# EAGLE design ProjekITS_5 (EAGLE 9.6.2)
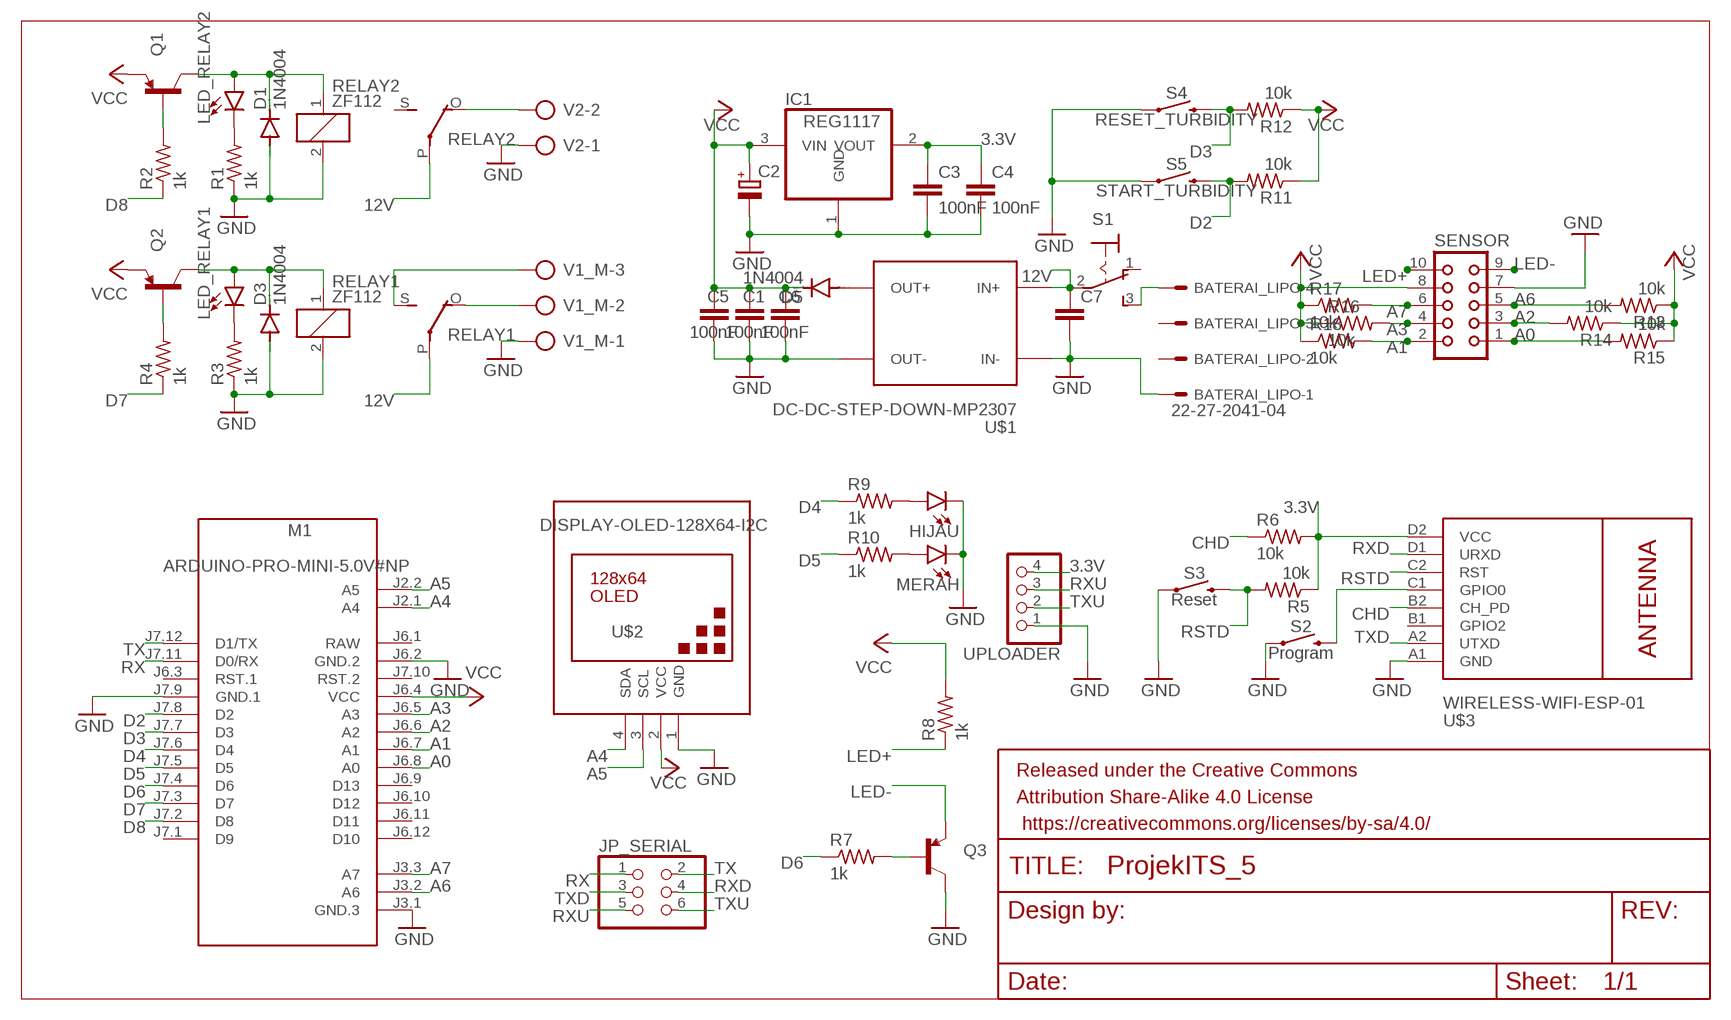
[diagram p0: schematic, sheet 1]

## Parts
BATERAI_LIPO  22-27-2041-04  [6410-04]
C1  100nF  C-EUC0805K  [C0805K]
C2  CPOL-EUCT3528  [CT3528]
C3  100nF  C-EUC0805K  [C0805K]
C4  100nF  C-EUC0805K  [C0805K]
C5  100nF  C-EUC0805K  [C0805K]
C6  100nF  C-EUC0805K  [C0805K]
C7  C-EU050-030X075  [C050-030X075]
D1  1N4004  [DO41-10]
D3  1N4004  [DO41-10]
D5  1N4004  [DO41-10]
FRAME1  FRAME-LETTER  [CREATIVE_COMMONS]
HIJAU  LED5MM  [LED_5MM]
IC1  REG1117  [SOT223]
JP_SERIAL  PINHD-2X3  [2X03]
LED_RELAY1  LED3MM  [LED_3MM]
LED_RELAY2  LED3MM  [LED_3MM]
M1  ARDUINO-PRO-MINI-5.0V#NP  [ARDUINO-PRO-MINI#NP]
MERAH  LED5MM  [LED_5MM]
Q1  TRANSISTOR_PNPSMD  [SOT23-3]
Q2  TRANSISTOR_PNPSMD  [SOT23-3]
Q3  TRANSISTOR_PNPSMD  [SOT23-3]
R1  1k  R-US_R0805  [R0805]
R2  1k  R-US_R0805  [R0805]
R3  1k  R-US_R0805  [R0805]
R4  1k  R-US_R0805  [R0805]
R5  10k  R-US_R0805  [R0805]
R6  10k  R-US_R0805  [R0805]
R7  1k  R-US_R0805  [R0805]
R8  1k  R-US_R0805  [R0805]
R9  1k  R-US_R0805  [R0805]
R10  1k  R-US_R0805  [R0805]
R11  10k  R-US_R0805  [R0805]
R12  10k  R-US_R0805  [R0805]
R13  10k  R-US_R0805  [R0805]
R14  10k  R-US_R0805  [R0805]
R15  10k  R-US_R0805  [R0805]
R16  10k  R-US_R0805  [R0805]
R17  10k  R-US_R0805  [R0805]
R18  10k  R-US_R0805  [R0805]
RELAY1  ZF112  [ZF112]
RELAY2  ZF112  [ZF112]
S1  320-916  [320-916]
S2  Program  MOMENTARY-SWITCH-SPST-PTH-6.0MM  [TACTILE_SWITCH_PTH_6.0MM]
S3  Reset  MOMENTARY-SWITCH-SPST-PTH-6.0MM  [TACTILE_SWITCH_PTH_6.0MM]
S4  RESET_TURBIDITY  MOMENTARY-SWITCH-SPST-PTH-6.0MM  [TACTILE_SWITCH_PTH_6.0MM]
S5  START_TURBIDITY  MOMENTARY-SWITCH-SPST-PTH-6.0MM  [TACTILE_SWITCH_PTH_6.0MM]
SENSOR  CON10L  [CON10L]
U$1  DC-DC-STEP-DOWN-MP2307  [DC-DC-STEP-DOWN-MP2307]
U$2  DISPLAY-OLED-128X64-I2C  [DISPLAY-OLED-128X64-I2C]
U$3  WIRELESS-WIFI-ESP-01  [WIRELESS-WIFI-ESP-01]
UPLOADER  PINHD-1X4/90  [1X04/90]
V1_M  AK500/3  [AK500/3]
V2  AK500/2  [AK500/2]

## Nets
3.3V: C3.1 C4.1 IC1.2(VOUT) R5.1 R6.2 U$3.D2(VCC) UPLOADER.4
12V: C7.1 RELAY1.P(2:P) RELAY2.P(2:P) S1.2(P) U$1.IN+
A0: M1.J6.8(A0) R15.2 SENSOR.1
A1: M1.J6.7(A1) R18.2 SENSOR.2
A2: M1.J6.6(A2) R14.2 SENSOR.3
A3: M1.J6.5(A3) R16.2 SENSOR.4
A4: M1.J2.1(A4) U$2.4(SDA)
A5: M1.J2.2(A5) U$2.3(SCL)
A6: M1.J3.2(A6) R13.2 SENSOR.5
A7: M1.J3.3(A7) R17.2 SENSOR.6
CHD: R6.1 U$3.B2(CH_PD)
D2: M1.J7.8(D2) R11.2 S5.3
D3: M1.J7.7(D3) R12.2 S4.3
D4: M1.J7.6(D4) R9.1
D5: M1.J7.5(D5) R10.1
D6: M1.J7.4(D6) R7.1
D7: M1.J7.3(D7) R4.1
D8: M1.J7.2(D8) R2.1
GND: BATERAI_LIPO.1 C1.2 C2.- C3.2 C4.2 C5.2 C6.2 C7.2 D1.A D3.A HIJAU.K(C) IC1.1(GND) M1.J3.1(GND.3) M1.J6.2(GND.2) M1.J7.9(GND.1) MERAH.K(C) Q3.3(C) R1.1 R3.1 RELAY1.2 RELAY2.2 S2.1 S3.1 S4.1 S5.1 SENSOR.7 U$1.IN- U$1.OUT- U$2.1(GND) U$3.A1(GND) UPLOADER.1 V1_M.1 V2.1
LED+: R8.1 SENSOR.10
LED-: Q3.2(E) SENSOR.9
N$1: D1.C LED_RELAY2.A Q1.3(C) RELAY2.1
N$2: HIJAU.A R9.2
N$3: D5.A U$1.OUT+
N$4: LED_RELAY2.K(C) R1.2
N$5: Q1.1(B) R2.2
N$6: D3.C LED_RELAY1.A Q2.3(C) RELAY1.1
N$7: LED_RELAY1.K(C) R3.2
N$8: Q2.1(B) R4.2
N$9: RELAY2.O(2:O) V2.2
N$10: RELAY1.S(2:S) V1_M.3
N$11: RELAY1.O(2:O) V1_M.2
N$12: MERAH.A R10.2
N$13: BATERAI_LIPO.4 S1.3(S)
N$16: Q3.1(B) R7.2
N$17: S2.3 U$3.C1(GPIO0)
RSTD: R5.2 S3.3 U$3.C2(RST)
RX: JP_SERIAL.1 M1.J7.11(D0/RX)
RXD: JP_SERIAL.4 U$3.D1(URXD)
RXU: JP_SERIAL.5 UPLOADER.3
TX: JP_SERIAL.2 M1.J7.12(D1/TX)
TXD: JP_SERIAL.3 U$3.A2(UTXD)
TXU: JP_SERIAL.6 UPLOADER.2
VCC: C1.1 C2.+ C5.1 C6.1 D5.C IC1.3(VIN) M1.J6.4(VCC) Q1.2(E) Q2.2(E) R8.2 R11.1 R12.1 R13.1 R14.1 R15.1 R16.1 R17.1 R18.1 SENSOR.8 U$2.2(VCC)
Unconnected: BATERAI_LIPO.2 BATERAI_LIPO.3 M1.J6.3(RST.1) M1.J6.9(D13) M1.J6.10(D12) M1.J6.11(D11) M1.J6.12(D10) M1.J7.1(D9) M1.J7.10(RST.2) RELAY2.S(2:S) S1.1(O) U$3.B1(GPIO2)

## Power pins joined to a net without a drawn wire
RAW: M1.J6.1(RAW)

## Library data of the parts
BATERAI_LIPO = con-molex:22-?-04: CONNECTOR wire to board 2.54 mm (.1 inch) pitch header; MF: MOLEX; OC_FARNELL: unknown; OC_NEWARK: unknown
C1 C3-C7 = rcl:C-EU: CAPACITOR, European symbol; SPICEPREFIX: C
C2 = rcl:CPOL-EU: POLARIZED CAPACITOR, European symbol; SPICEPREFIX: C
D1 D3 D5 = diode:1N4004: DIODE general purpose rectifier, 1 A
FRAME1 = SparkFun-Aesthetics:FRAME-LETTER: Schematic Frame - Letter Standard 8.5x11 US Letter frame
HIJAU MERAH = SparkFun-LED:LED: LED (Generic) Standard schematic elements and footprints for 5mm, 3mm, 1206, and 0603 sized LEDs. Generic LEDs with no color specified.
IC1 = burr-brown:REG1117: 800mA and 1A Low Dropout (LDO) Positive Regulator 1.8V, 2.5V, 2.85V, 3.3V, 5V, and Adj; MPN: REG1117; OC_FARNELL: 1097566; OC_NEWARK: 14P6981
JP_SERIAL = pinhead:PINHD-2X3: PIN HEADER
LED_RELAY1 LED_RELAY2 = SparkFun-LED:LED: LED (Generic) Standard schematic elements and footprints for 5mm, 3mm, 1206, and 0603 sized LEDs. Generic LEDs with no color specified.; PROD_ID: DIO-08794
M1 = diy-modules:ARDUINO-PRO-MINI-*#NP: Arduino Pro Mini (and compatible devices) without programming pads More details available here: https://www.arduino.cc/en/Main/ArduinoBoardProMini Click here to find device on ebay.com <http://www.ebay.com/sch/arduino+pro+mini>
Q1-Q3 = User-Submitted:TRANSISTOR_PNP: Generic PNP BJT Double check pinouts against datasheets- not all devices are the same! MMBT3906 - 40V 200mA SOT-23 (TRANS-08052) MMBT4403 - 40V 600mA SOT-23 (TRANS-09245)
R1-R18 = rcl:R-US_: RESISTOR, American symbol; SPICEPREFIX: R
RELAY1 RELAY2 = relay:ZF112: RELAY 1 x switch; OC_FARNELL: unknown; OC_NEWARK: unknown
S1 = switch:320-916: TOGGLE SWITCH distributor RS Components
S2-S5 = SparkFun-Switches:MOMENTARY-SWITCH-SPST: Momentary Switch (Pushbutton) - SPST Normally-open (NO) SPST momentary switches (buttons, pushbuttons). Variants PTH-12MM - 12mm square, through-hole Momentary Pushbutton Switch - 12mm Square <https://www.sparkfun.com/products/9190> (COM-09190) PTH-6.0MM, PTH-6.0MM-KIT - 6.0mm square, through-hole Mini Pushbutton Switch <https://www.sparkfun.com/products/97> (COM-00097) KIT package intended for soldering kit's - only one side of pads' copper is exposed. PTH-RIGHT-ANGLE-KIT - Right-angle, through-hole Right Angle Tactile Button <https://www.sparkfun.com/products/10791> - Used on SparkFun BigTime Watch Kit <https://www.sparkfun.com/products/11734> SMD-12MM - 12mm square, surface-mount Tactile Button - SMD (12mm) <https://www.sparkfun.com/products/12993> (COM-12993) Used on SparkFun PicoBoard <https://www.sparkfun.com/products/11888> SMD-4.5MM - 4.5mm Square Trackball Switch Used on SparkFun Blackberry Trackballer Breakout <https://www.sparkfun.com/products/13169> SMD-4.6MMX2.8MM - 4.60mm x 2.80mm, surface mount Used on SparkFun SAMD21 Mini Breakout <https://www.sparkfun.com/products/13664> SMD-5.2MM, SMD-5.2-REDUNDANT - 5.2mm square, surface-mount Mini Pushbutton Switch - SMD <https://www.sparkfun.com/products/8720> (COM-08720) Used on Arduino Pro Mini <https://www.sparkfun.com/products/11114> REDUNDANT package connects both switch circuits together SMD-6.0X3.5MM - 6.0 x 3.5mm, surface mount Momentary Reset Switch SMD <https://www.sparkfun.com/products/8229> (COM-08229) SMD-6.2MM-TALL - 6.2mm square, surface mount Tactile Button - SMD (6mm) <https://www.sparkfun.com/products/12992> Used on SparkFun Digital Sandbox <https://www.sparkfun.com/products/12651> SMD-RIGHT-ANGLE - Right-angle, surface mount Used on SparkFun Block for Intel® Edison - Arduino <https://www.sparkfun.com/products/13036>; PROD_ID: SWCH-08441; SF_SKU: COM-00097
SENSOR = con-harting:CON10L: CONNECTOR; OC_FARNELL: unknown; OC_NEWARK: unknown
U$1 = diy-modules:DC-DC-STEP-DOWN-MP2307: DC/DC Step-Down Regulator based on MP2307DN chip MP2307 datasheet available here: https://cdn-shop.adafruit.com/datasheets/MP2307_r1.9.pdf Click here to find device on ebay.com <http://www.ebay.com/sch/dc+dc+3a+mini+converter>
U$2 = diy-modules:DISPLAY-OLED-128X64-I2C: 128x64 Dot Matrix OLED Module based on SSD1306 chip Variant with I2C interface More details available here: http://www.instructables.com/id/Monochrome-096-i2c-OLED-display-with-arduino-SSD13/ SSD1306 datasheet: https://cdn-shop.adafruit.com/datasheets/SSD1306.pdf Click here to find device on ebay.com <http://www.ebay.com/sch/oled+display+128x64+iic> Note: There are two variants: I2C and SPI. Search for the proper version.
U$3 = diy-modules:WIRELESS-WIFI-ESP-01: Wireless Wi-Fi ESP-01 Module based on ESP8266 chip Click here to find device on ebay.com <http://www.ebay.com/sch/esp8266+esp+01+transceiver>
UPLOADER = pinhead:PINHD-1X4: PIN HEADER
V1_M = con-ptr500:AK500/3: CONNECTOR; OC_FARNELL: unknown; OC_NEWARK: unknown
V2 = con-ptr500:AK500/2: CONNECTOR; OC_FARNELL: unknown; OC_NEWARK: unknown

## Board
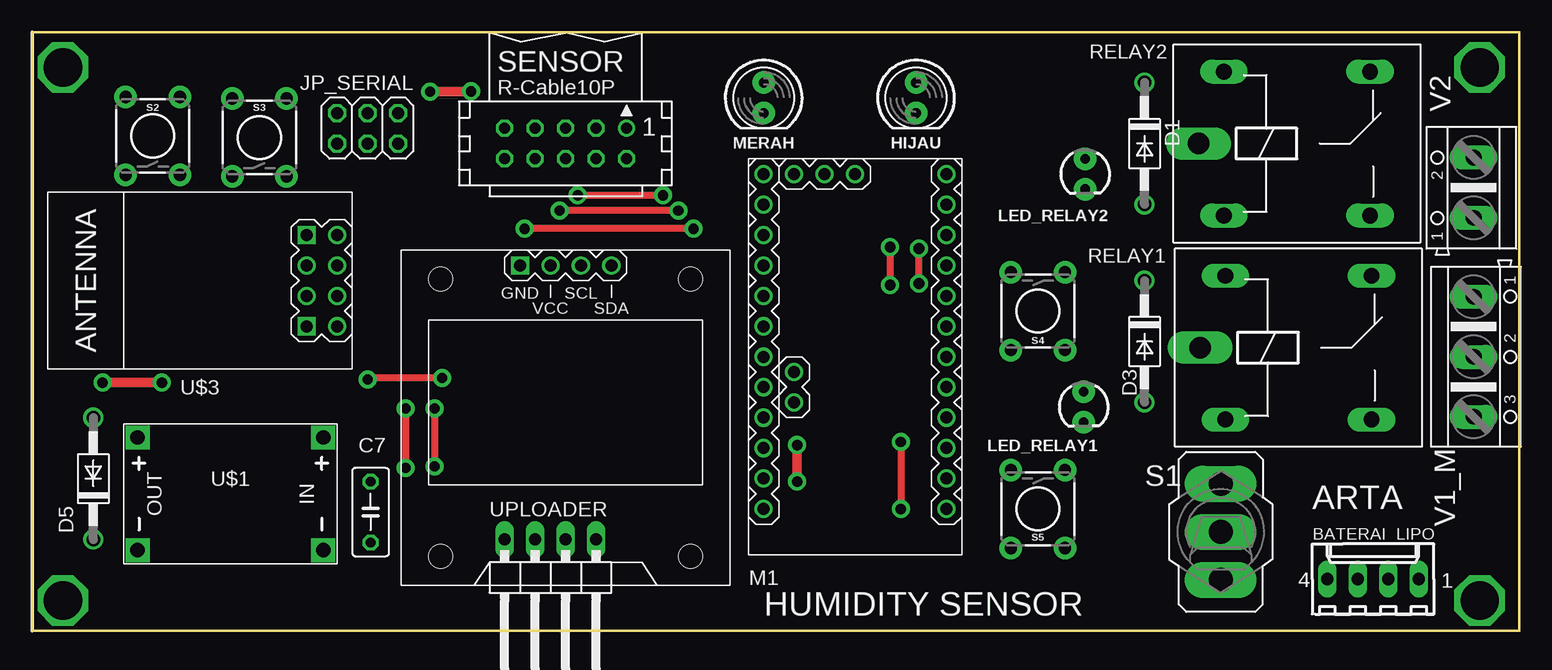
[diagram p1: board, top side]
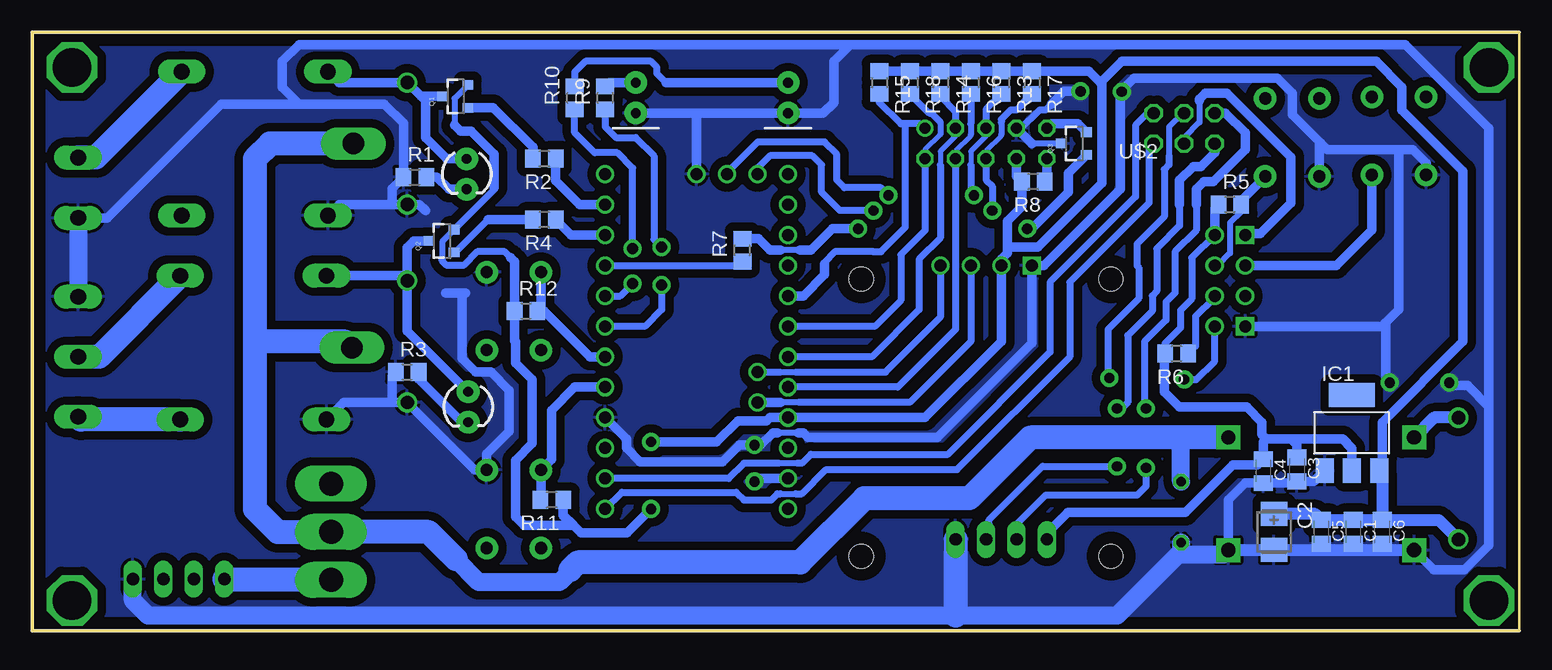
[diagram p2: board, bottom side, seen from below]

Size 123.95 x 49.91 mm. Coordinates in mm from the lower left corner, seen from the top.
Outline: 0,0 123.95,0 123.95,49.91 0,49.91 0,0
Copper layers (1*16): Top 0.035mm / dielectric 1.5mm / Bottom 0.035mm
Design rules "default": minimum track width 6mil, minimum drill 0.35mm, track to track 6mil, track to pad 6mil, pad to pad 6mil, via to via 6mil, smd to smd 6mil, copper to edge 40mil, drill to drill 6mil, minimum pad ring 10mil, minimum via ring 8mil, stop-mask expansion 4mil, vias tented up to drill 0mil, thermal gap 10mil

### Footprints (pad centres in the part's own frame; a part is rotated, then mirrored left to right if it is on the bottom)
6410-04 = drill 1.016 long: 1 3.81,0; 2 1.27,0; 3 -1.27,0; 4 -3.81,0
C0805K = smd 1.3 x 1.6: 1 -1,0; 2 1,0
CT3528 = smd 2 x 2.2: + -1.5,0; - 1.5,0
C050-030X075 = drill 0.813 octagon: 1 -2.54,0; 2 2.54,0
DO41-10 = drill 1.118: A 5.08,0; C -5.08,0
LED_5MM = drill 0.813 pad 1.88: A -1.27,0; K 1.27,0
SOT223 = smd 1.499 x 2.007: 1 -2.261,-3.15; 2 0.025,-3.15; 3 2.311,-3.15 | smd 3.81 x 2.007: 4 0,3.15
2X03 = drill 1.016 octagon: 1 -2.54,-1.27; 2 -2.54,1.27; 3 0,-1.27; 4 0,1.27; 5 2.54,-1.27; 6 2.54,1.27
LED_3MM = drill 0.813 pad 1.88: A -1.27,0; K 1.27,0
ARDUINO-PRO-MINI#NP = drill 1: J2.1 -1.27,5.08; J2.2 -3.81,5.08; J3.1 15.24,0; J3.2 15.24,2.54; J3.3 15.24,5.08; J6.1 -12.7,7.62; J6.2 -10.16,7.62; J6.3 -7.62,7.62; J6.4 -5.08,7.62; J6.5 -2.54,7.62; J6.6 0,7.62; J6.7 2.54,7.62; J6.8 5.08,7.62; J6.9 7.62,7.62; J6.10 10.16,7.62; J6.11 12.7,7.62; J6.12 15.24,7.62; J7.1 15.24,-7.62; J7.2 12.7,-7.62; J7.3 10.16,-7.62; J7.4 7.62,-7.62; J7.5 5.08,-7.62; J7.6 2.54,-7.62; J7.7 0,-7.62; J7.8 -2.54,-7.62; J7.9 -5.08,-7.62; J7.10 -7.62,-7.62; J7.11 -10.16,-7.62; J7.12 -12.7,-7.62
SOT23-3 = smd 0.8 x 0.9: 1 -0.95,-1; 2 0.95,-1; 3 0,1.1
R0805 = smd 1.3 x 1.5: 1 -0.95,0; 2 0.95,0
ZF112 = drill 1.321 long: 1 -6.096,5.994; 2 -6.096,-5.994; O 6.096,5.994; S 6.096,-5.994 | drill 1.803 long: P -8.204,0
320-916 = drill 2.007 long: 1 0,4.013; 2 0,0; 3 0,-4.013
TACTILE_SWITCH_PTH_6.0MM = drill 1.016 pad 1.88: 1 -3.251,2.261; 2 3.251,2.261; 3 -3.251,-2.261; 4 3.251,-2.261
CON10L = drill 0.914: 1 5.08,1.27 | drill 0.914 octagon: 2 5.08,-1.27; 3 2.54,1.27; 4 2.54,-1.27; 5 0,1.27; 6 0,-1.27; 7 -2.54,1.27; 8 -2.54,-1.27; 9 -5.08,1.27; 10 -5.08,-1.27
DC-DC-STEP-DOWN-MP2307 = drill 1.2 pad 2 square: IN+ -7.747,-4.699; IN- -7.747,4.699; OUT+ 7.747,-4.699; OUT- 7.747,4.699
DISPLAY-OLED-128X64-I2C = drill 1 square: 1 -3.81,12.7 | drill 1: 2 -1.27,12.7; 3 1.27,12.7; 4 3.81,12.7 | hole 2: -10.414,11.557; 10.414,11.557; 10.414,-11.557; -10.414,-11.557
WIRELESS-WIFI-ESP-01 = drill 1 square: A1 -8.89,3.81; D1 -8.89,-3.81 | drill 1: A2 -11.43,3.81; B1 -8.89,1.27; B2 -11.43,1.27; C1 -8.89,-1.27; C2 -11.43,-1.27; D2 -11.43,-3.81
1X04/90 = drill 1.016 long: 1 -3.81,-3.81; 2 -1.27,-3.81; 3 1.27,-3.81; 4 3.81,-3.81
AK500/3 = drill 1.321 long: 1 -5.004,0; 2 0,0; 3 5.004,0
AK500/2 = drill 1.321 long: 1 -2.515,0; 2 2.515,0

### Placement (x,y rotation side)
BATERAI_LIPO  111.76,4.32 0 top
C1  13.84,8.26 270 bottom
C2  20.45,8.26 270 bottom
C3  18.54,13.46 270 bottom
C4  21.34,13.34 270 bottom
C5  16.51,8.26 270 bottom
C6  11.43,8.26 270 bottom
C7  28.19,9.91 270 top
D1  92.71,40.64 270 top
D3  92.71,24.13 270 top
D5  5.08,12.7 90 top
FRAME1  21.59,-11.43 0 top  (outside the outline)
HIJAU  73.66,44.45 270 top
IC1  13.97,16.51 0 bottom
JP_SERIAL  27.94,41.91 180 top
LED_RELAY1  87.63,18.67 270 top
LED_RELAY2  87.76,38.1 270 top
M1  68.58,22.86 90 top
MERAH  60.96,44.45 270 top
Q1  88.65,44.58 90 bottom
Q2  89.79,32.51 90 bottom
Q3  37.08,40.64 90 bottom
R1  92.08,37.85 0 bottom
R2  81.28,39.37 180 bottom
R3  92.71,21.59 0 bottom
R4  81.28,34.29 180 bottom
R5  24.13,35.56 0 bottom
R6  28.57,23.11 180 bottom
R7  64.77,31.75 90 bottom
R8  40.51,37.47 180 bottom
R9  76.2,44.45 90 bottom
R10  78.74,44.45 90 bottom
R11  80.64,10.92 180 bottom
R12  82.8,26.67 0 bottom
R13  43.18,45.72 270 bottom
R14  48.26,45.72 270 bottom
R15  53.34,45.72 270 bottom
R16  45.72,45.72 270 bottom
R17  40.64,45.72 270 bottom
R18  50.8,45.72 270 bottom
RELAY1  105.54,23.62 0 top
RELAY2  105.41,40.64 0 top
S1  99.06,8.26 0 top
S2  10.03,41.27 90 top
S3  18.92,41.15 90 top
S4  83.82,26.67 270 top
S5  83.82,10.16 270 top
SENSOR  44.45,40.64 0 top
U$1  16.51,11.43 180 top
U$2  44.45,17.78 0 top
U$3  13.97,29.21 180 top
UPLOADER  43.18,3.81 180 top
V1_M  120.14,22.86 270 top
V2  120.14,36.96 90 top

### Tracks (layer width: path | path; a pad name or v marks a point on that pad's centre or on a via)
3.3V
  Bottom 0.6: U$3.D2 27.3,31.11 27.3,27.69 28.25,26.74 28.25,25.27 29.52,24 R6.2
  Bottom 0.8: R5.1 25.4,35.24 U$3.D2 | IC1.2 13.95,15.21 14.73,16 19.05,16 | 19.05,16 21.08,16 | 21.08,16 21.34,15.75 C4.1 21.83,13.84 23.88,13.84 27.84,9.88 37.62,9.88 39.37,8.13 UPLOADER.4 | 19.05,16 18.54,15.49 C3.1 | 21.08,16 21.46,16.38 21.46,17.4 22.73,18.67 28.32,18.67 29.59,19.94 29.59,23.05 R6.2
12V
  Bottom 1.5: C7.1 28.19,15.88 27.94,16.13 | 78.49,5.71 78.49,5.59 80.01,4.06 86.74,4.06 88.65,5.97
  Bottom 2: U$1.IN+ 27.94,16.13 40.77,16.13 45.85,11.05 54.61,11.05 59.94,5.71 78.49,5.71 79.12,5.08 | 88.65,5.97 90.93,8.26 S1.2 103.5,8.26 105.41,10.16 105.41,24.13 | RELAY2.P 104.14,40.64 105.41,39.37 105.41,24.13 | RELAY1.P 97.84,24.13 105.41,24.13
A0
  Bottom 0.6: SENSOR.1 49.91,42.29 51.18,42.29 | R15.2 53.34,44.07 51.56,42.29 51.18,42.29 | 57.91,30.48 57.91,30.73 56.99,31.65 53.91,31.65 53.88,31.62 53.21,31.62 51.18,33.66 51.18,42.29
  Bottom 0.8: M1.J6.8 59.69,27.94 57.91,29.72 57.91,30.48 57.91,30.61
A1
  Bottom 0.4: SENSOR.2 49.53,40.13 48.26,41.4
  Bottom 0.5: 48.26,42.42 48.26,41.4
  Bottom 0.6: 50.8,44.45 R18.2 49.21,43.18 49.02,43.18 48.26,42.42 | SENSOR.2 49.53,33.4 51.56,31.37 51.56,27.56 53.72,25.4 M1.J6.7
A2
  Bottom 0.4: SENSOR.3 46.99,41.27 48.26,40.01 48.26,38.86
  Bottom 0.6: R14.2 48.26,44.58 46.99,43.31 SENSOR.3 | 48.26,38.86 48.26,32.77 50.04,30.99 50.04,26.8 53.98,22.86 M1.J6.6
A3
  Bottom 0.4: 45.72,41.4 45.72,41.27 46.99,40.01 SENSOR.4
  Bottom 0.5: 45.72,42.29 45.72,41.4
  Bottom 0.6: 45.72,44.2 R16.2 45.72,42.29 | M1.J6.5 51.82,20.32 46.99,25.15 SENSOR.4
A4
  Bottom 0.5: 61.59,21.59 60.33,21.59
  Bottom 0.6: U$2.4 48.26,26.16 52.83,21.59 60.33,21.59 | M1.J2.1 61.59,21.59
A5
  Bottom 0.5: 60.07,19.05 61.59,19.05
  Bottom 0.6: U$2.3 45.72,24.13 50.8,19.05 60.07,19.05
  Bottom 0.8: 61.59,19.05 M1.J2.2
A6  (via drill 0.85 pad 1.5)
  Top 0.6: v45.47,36.32 v52.58,36.32
  Bottom 0.4: 45.72,38.86 45.72,40.01 44.45,41.27 SENSOR.5
  Bottom 0.6: R13.2 44.45,43.5 SENSOR.5 | 45.72,38.86 45.72,36.58 v45.47,36.32 | v52.58,36.32 53.21,36.96 56.26,36.96 56.9,37.59 56.9,39.75 57.91,40.77 63.5,40.77 66.04,38.23 M1.J3.2
A7  (via drill 0.85 pad 1.5)
  Top 0.6: v53.85,35.05 v43.94,35.05
  Bottom 0.4: 43.18,41.4 43.18,41.27 44.45,40.01 SENSOR.6
  Bottom 0.5: 43.18,42.42 43.18,41.4
  Bottom 0.6: R17.2 41.27,44.13 41.27,44.07 41.91,43.43 42.42,43.43 43.18,42.67 43.18,42.42 | SENSOR.6 44.45,37.59 43.94,37.08 v43.94,35.05 | v53.85,35.05 56.64,35.05 58.17,36.58 58.17,38.86 58.93,39.62 62.48,39.62 63.5,38.61 M1.J3.3
CHD
  Bottom 0.6: R6.1 26.99,23.75 26.99,26.22 25.4,27.81 U$3.B2
D2
  Bottom 0.8: R11.2 81.56,10.96 S5.3 80.67,14.3 80.67,18.39 78.74,20.32 M1.J7.8
D3
  Bottom 0.8: M1.J7.7 77.47,22.86 81.28,26.67 81.79,26.67 | 81.79,26.67 R12.2 | S4.3 81.56,26.9 81.79,26.67
D4  (via drill 0.9 pad 1.5)
  Top 0.6: v71.5,32 v71.5,28.83
  Bottom 0.6: R9.1 76.2,42.04 75.31,41.15 73.66,41.15 72.14,39.62 72.14,32.64 v71.5,32 | v71.5,28.83 71.5,26.8 72.9,25.4 M1.J7.6
D5  (via drill 0.9 pad 1.5)
  Top 0.6: v73.91,28.96 v73.91,31.88
  Bottom 0.6: M1.J7.5 74.93,27.94 v73.91,28.96 | v73.91,31.88 73.91,38.61 75.18,39.88 77.09,39.88 78.74,41.53 R10.1
D6
  Bottom 0.6: M1.J7.4 65.09,30.48 R7.1
D7
  Bottom 0.8: R4.1 79.06,33.02 M1.J7.3
D8
  Bottom 0.8: M1.J7.2 78.36,35.56 80.33,37.53 R2.1
GND  (via drill 0.85 pad 1.5)
  Top 0.8: v36.58,44.99 36.55,44.96 v33.15,44.96 | v63.75,15.49 v63.75,12.45 | v5.84,20.7 v10.79,20.7
  Bottom 0.5: Q3.3 40.64,40.64 | 60.07,16.51 61.85,16.51
  Bottom 0.6: 38.99,43.94 39.5,43.43 40.01,43.43 41.66,41.78 41.66,41.66
  Bottom 0.8: 40.64,40.64 41.66,41.66 SENSOR.7 | 33.27,44.96 v33.15,44.96 | v36.58,44.99 37.94,44.99 38.99,43.94 | 33.27,44.96 33.27,36.83 39.62,30.48 U$2.1 40.64,24 48.51,16.13 59.31,16.13 59.69,16.51 60.07,16.51 | S2.1 7.77,39.01 8.89,40.13 10.03,40.13 | 10.03,40.13 16,40.13 18.92,43.05 18.92,44.83 20.19,46.1 32.13,46.1 33.27,44.96 | S3.1 16.66,40.56 16.55,40.68 | IC1.1 17.13,12.46 C3.2 18.67,12.34 C4.2 22.84,12.34 24.26,10.92 U$1.IN- | 61.85,16.51 62.23,16.51 63.25,15.49 v63.75,15.49 65.02,15.49 66.42,14.1 73.28,14.1 74.42,15.24 74.42,16 M1.J7.9 | v63.75,12.45 63.5,12.7 M1.J6.2 | U$3.A1 11.43,25.4 11.11,25.72 | 10.03,40.13 10.03,26.8 11.11,25.72 | U$1.OUT- 7.11,5.08 4.57,5.08 2.54,7.11 2.54,18.67 | 2.54,18.67 4.32,20.45 5.59,20.45 v5.84,20.7 | v10.79,20.7 11.11,21.02 11.11,25.72 | 68.58,43.18 MERAH.K 58.04,43.18 57.15,44.07 57.15,47.5 55.75,48.9 | 68.58,43.18 HIJAU.K | M1.J3.1 68.58,43.18 | 93.98,19.05 D3.A 87.07,13.41 S5.1 86.08,14.76 84.2,16.64 84.2,20.07 85.72,21.59 87,21.59 88.14,22.73 88.14,27.86 87.85,28.16 89.5,28.16 | 93.98,19.05 98.02,19.05 RELAY1.2 | R3.1 93.98,21.27 93.98,19.05 | 2.54,18.67 2.54,41.91 9.53,48.9 55.75,48.9 | 55.75,48.9 101.73,48.9 103.12,47.5 103.12,45.34 101.73,43.94 | 93.98,35.56 D1.A 91.69,35.56 91.19,35.05 | 93.98,35.56 98.4,35.56 RELAY2.2 | 93.98,35.56 93.98,36.89 R1.1 93.03,42.35 94.61,43.94 101.73,43.94 | 101.73,43.94 108.2,43.94 117.7,34.44 V2.1
  Bottom 1: U$1.OUT- 11.43,6.73 | 11.43,6.73 13.84,6.73 | 13.84,6.73 16.51,6.73 | 16.51,6.73 20.45,6.73 | 20.45,6.73 U$1.IN- | C2.- 20.45,6.73 | C5.2 16.51,6.73 | C1.2 13.84,6.73 | C6.2 11.43,6.73
  Bottom 1.5: U$1.IN- 24.64,6.35 27.94,6.35 28.19,6.6 | C7.2 28.19,6.6 | 28.19,6.6 33.53,1.27 46.99,1.27 114.3,1.27 115.57,2.54 BATERAI_LIPO.1 | V2.1 V1_M.1
  Bottom 2: UPLOADER.1 46.99,1.27
  pour Bottom (isolate 0.7): 0,0 123.95,0 123.95,49.91 0,49.91
LED+
  Bottom 0.8: SENSOR.10 39.37,37.66 R8.1
LED-
  Bottom 0.8: Q3.2 36.78,42.29 38.99,42.29 SENSOR.9
N$1
  Bottom 0.8: RELAY2.1 98.4,45.72 D1.C 91.57,44.58 | 91.57,44.58 91.19,44.2 91.19,41.15 89.41,39.37 LED_RELAY2.A | 91.57,44.58 Q1.3
N$2
  Bottom 0.8: R9.2 75.88,45.72 HIJAU.A
N$3
  Bottom 1: D5.A 7.11,17.78 U$1.OUT+
N$4
  Bottom 0.8: R1.2 90.24,37.85 89.22,36.83 LED_RELAY2.K
N$5
  Bottom 0.8: Q1.1 85.54,43.63 82.23,40.32 R2.2
N$6
  Bottom 0.8: Q2.3 92.16,32.51 92.71,31.96 D3.C | D3.C 93.12,29.62 RELAY1.1 | LED_RELAY1.A 92.71,25.02 D3.C
N$7
  Bottom 0.8: R3.2 91.76,21.02 88.14,17.4 LED_RELAY1.K
N$8
  Bottom 0.6: 85.98,34.29 88.71,31.56 Q2.1
  Bottom 0.8: R4.2 85.98,34.29
N$9
  Bottom 2: RELAY2.O 118.67,39.47 V2.2
N$10
  Bottom 2: RELAY1.S 119.91,17.63 V1_M.3
N$11
  Bottom 2: RELAY1.O 118.39,22.86 V1_M.2
N$12
  Bottom 0.6: 71.12,45.72 71.88,46.48 71.88,46.99 72.39,47.5 77.85,47.5 78.74,46.61 R10.2
  Bottom 0.8: MERAH.A 71.12,45.72
N$13
  Bottom 2: S1.3 107.87,4.24 BATERAI_LIPO.4
N$14  (via drill 3.2)
  other vias: 2.54,46.99
N$15  (via drill 3.2)
  other vias: 2.54,2.54
N$16  (via drill 0.85 pad 1.5)
  Top 0.6: v55.12,33.53 v41.02,33.53
  Bottom 0.5: 59.94,31.75 61.59,31.75
  Bottom 0.8: Q3.1 37.59,38.18 37.59,36.58 40.64,33.53 v41.02,33.53 | v55.12,33.53 57.28,33.53 59.05,31.75 59.94,31.75 | 61.59,31.75 62.48,31.75 63.43,32.7 R7.2
N$17
  Bottom 0.8: U$3.C1 15.24,30.48 12.29,33.43 S2.3
N$18  (via drill 3.2)
  other vias: 120.65,2.54
N$19  (via drill 3.2)
  other vias: 120.65,46.99
N$20
  Bottom 0.2: 0,0 123.95,0 123.95,49.91 0,49.91 0,0
RSTD
  Bottom 0.5: R5.2 23.18,34.99 24.13,34.04 24.13,31.5 25.15,30.48 U$3.C2
  Bottom 0.8: 21.18,37.94 S3.3 23.18,35.9 R5.2
RX
  Bottom 0.5: 60.2,13.97 61.72,13.97
  Bottom 0.6: JP_SERIAL.1 30.99,43.18 32,42.16 32,36.2 39.12,29.08 39.12,23.24 47.62,14.73 59.05,14.73 59.82,13.97 60.2,13.97 | M1.J7.11 65.91,12.7 64.64,13.97 61.72,13.97
RXD
  Bottom 0.5: JP_SERIAL.4 27.94,41.15 26.67,42.42 26.67,44.2
  Bottom 0.8: U$3.D1 22.73,33.15 21.59,33.15 19.05,35.69 19.05,39.5 24.38,44.83 26.16,44.83 26.67,44.32 26.67,44.2
RXU  (via drill 0.85 pad 1.5)
  Top 0.6: v31.11,18.54 v31.11,13.59
  Bottom 0.6: 26.92,35.56 26.92,33.4 28.7,31.62 28.7,28.19 29.46,27.43 29.46,25.91 31.24,24.13 31.24,18.67 v31.11,18.54 | UPLOADER.3 41.91,8.89 39.5,11.3 31.88,11.3 31.11,12.06 v31.11,13.59
  Bottom 0.8: 26.92,35.56 26.92,36.83 26.29,37.47 25.53,37.47 22.86,40.13 22.86,41.53 24.51,43.18 JP_SERIAL.5
TX
  Bottom 0.5: 61.59,11.43 60.33,11.43
  Bottom 0.6: JP_SERIAL.2 30.86,40.26 30.86,35.69 37.47,29.08 37.47,22.86 46.86,13.46 57.78,13.46 59.82,11.43 60.33,11.43 | M1.J7.12 74.8,11.56 65.28,11.56 64.64,10.92 62.36,10.92 61.85,11.43 61.59,11.43
TXD  (via drill 0.85 pad 1.5)
  Top 0.6: v34.16,21.08 28.07,21.08 v27.94,20.95
  Bottom 0.5: JP_SERIAL.3 28.07,43.18 29.21,42.04 29.21,39.62
  Bottom 0.6: 29.21,39.62 29.21,38.86 29.59,38.48 29.59,34.54 31.88,32.26 31.88,30.45 31.72,30.3 31.72,27.72 34.29,25.15 34.29,21.21 v34.16,21.08 | v27.94,20.95 26.92,20.95 25.4,22.48 U$3.A2
TXU  (via drill 0.85 pad 1.5)
  Top 0.6: v33.53,18.54 v33.53,13.72
  Bottom 0.6: 28.32,35.56 28.32,33.78 30.23,31.88 30.23,28.32 30.61,27.94 30.61,26.67 32.64,24.64 32.64,19.05 33.15,18.54 v33.53,18.54 | UPLOADER.2 44.45,8.64 44.2,8.89 44.2,9.27 39.75,13.72 v33.53,13.72
  Bottom 0.8: JP_SERIAL.6 25.4,39.88 26.54,38.73 27.18,38.73 28.32,37.59 28.32,35.56
VCC  (via drill 0.85 pad 1.5)
  Top 0.6: v72.39,15.75 v72.39,10.16
  Bottom 0.5: 89.79,30.99 89.79,32.46 Q2.2 | Q1.2 88.77,44.4 88.77,42.16
  Bottom 0.6: 83.75,30.8 84.58,31.62 86.87,31.62 88.01,30.48 89.41,30.48 89.79,30.86 89.79,30.99 | Q2.2 85.47,36.78 85.47,36.96
  Bottom 0.8: R15.1 R18.1 R14.1 R16.1 R13.1 R17.1 35.88,46.67 34.92,45.72 | SENSOR.8 41.91,37.91 R8.2 41.46,35.37 42.67,34.16 42.67,32 | 42.67,32 42.67,31.5 43.18,30.99 U$2.2 43.18,24.13 49.53,17.78 M1.J6.4 62.48,17.78 62.74,17.53 65.15,17.53 66.93,15.75 v72.39,15.75 | 42.67,32 40.13,32 34.8,37.34 34.8,45.59 34.92,45.72 | R11.1 79.69,9.65 78.84,8.79 | IC1.3 11.43,13.59 11.43,17.4 4.7,24.13 4.7,38.35 9.78,43.43 9.78,45.34 11.94,47.5 33.14,47.5 34.92,45.72 | 84.07,31.11 83.75,30.8 R12.1 83.75,24.19 83.69,24.13 83.69,22.35 82.3,20.95 82.3,15.62 83.69,14.22 83.69,9.53 82.96,8.79 78.84,8.79 | v72.39,10.16 74.39,8.16 78.2,8.16 78.84,8.79 | 85.47,36.96 85.47,39.75 87.38,41.66 88.27,41.66 88.77,42.16
  Bottom 1: C6.1 C1.1 C5.1 17.01,9.76 C2.+ | C6.1 6.71,9.26 D5.C | IC1.3 11.43,13.13 C6.1

### Text on the board
tNames: ARTA | HUMIDITY SENSOR